# EAGLE design Glucose_Meter_Rev1 (EAGLE 7.6.0)
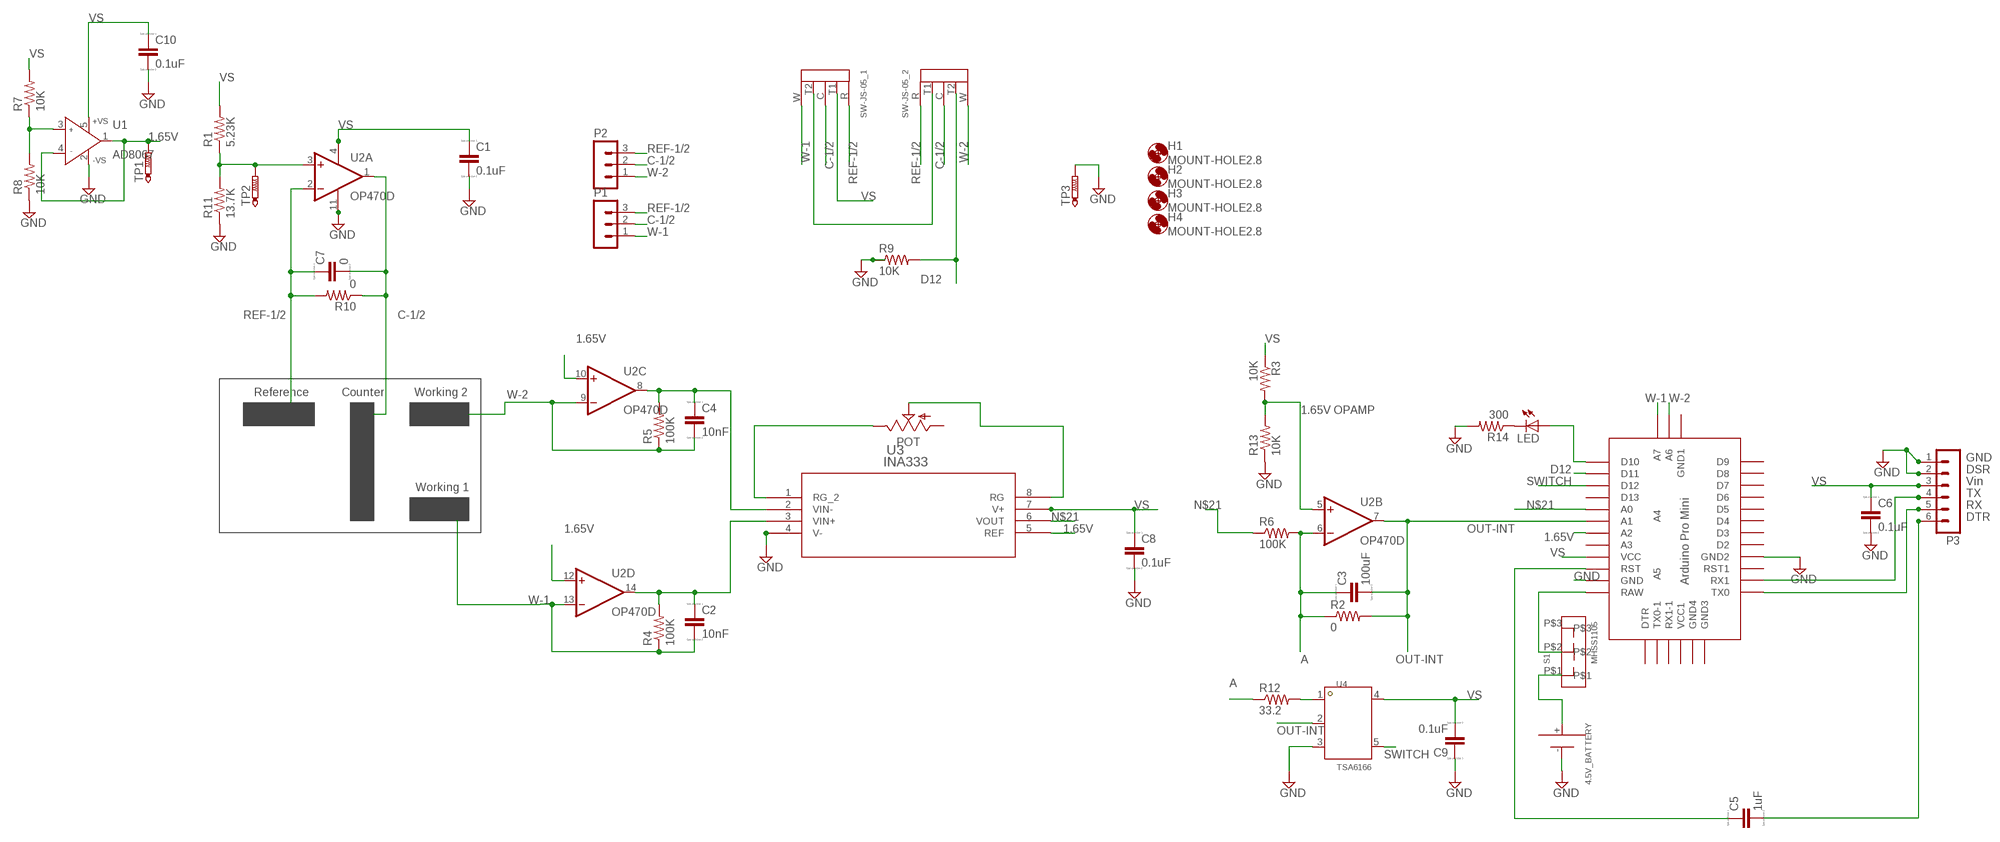
[diagram p0: schematic, sheet 1]

## Parts
4.5V_BATTERY  BC3AAAPC  [BC3AAAPC]
C1  0.1uF  C  [C0805]
C2  10nF  C  [C0805]
C3  100uF  CC1210  [C1210]
C4  10nF  C  [C0805]
C5  1uF  C  [C0805]
C6  0.1uF  C  [C0805]
C7  0  C  [C0805]
C8  0.1uF  C  [C0805]
C9  0.1uF  C  [C0805]
C10  0.1uF  C  [C0805]
H1  MOUNT-HOLE2.8  [2,8]
H2  MOUNT-HOLE2.8  [2,8]
H3  MOUNT-HOLE2.8  [2,8]
H4  MOUNT-HOLE2.8  [2,8]
LED  LED3MM  [LED3MM]
P1  MA03-1  [MA03-1]
P2  MA03-1  [MA03-1]
P3  MA06-1  [MA06-1]
POT  TRIM_US-RJ9W  [RJ9W]
R1  5.23K  R-US_R0805  [R0805]
R2  0  R-US_R0805  [R0805]
R3  10K  R-US_R0805  [R0805]
R4  100K  R-US_R0805  [R0805]
R5  100K  R-US_R0805  [R0805]
R6  100K  R-US_R0805  [R0805]
R7  10K  R-US_R0805  [R0805]
R8  10K  R-US_R0805  [R0805]
R9  10K  R-US_R0805  [R0805]
R10  0  R-US_R0805  [R0805]
R11  13.7K  R-US_R0805  [R0805]
R12  33.2  R-US_R0805  [R0805]
R13  10K  R-US_R0805  [R0805]
R14  300  R-US_R0805  [R0805]
S1  MHSS1105  [MHSS1105]
SW-JS-05_1  SW-JS-05  [SW-JS-05]
SW-JS-05_2  SW-JS-05  [SW-JS-05]
TP1  PTR1PAD1-13  [P1-13]
TP2  PTR1PAD1-13  [P1-13]
TP3  PTR1PAD1-13  [P1-13]
U1  AD8067  [SOT23-5]
U2  OP470D  [SO14]
U3  INA333  INA333_DGK_8  [DGK8]
U4  TSA6166  [SOT23-5]
U$1  ABK-PRO-MINI  [ABK-PRO-MINI]

## Nets
1.65V: TP1.TP U1.1(OUT) U1.4(IN-) U2.10(C:+IN) U2.12(D:+IN) U3.5(REF) U$1.A2
4.5V_BATTERY: S1.P$2 U$1.RAW
A: C3.1 R2.1 R6.2 R12.1 U2.6(B:-IN)
C-1/2: C7.2 P1.2 P2.2 R10.1 SW-JS-05_1.C SW-JS-05_2.C U2.1(A:OUT)
D12: R9.2 SW-JS-05_2.T2 U$1.D11
GND: 4.5V_BATTERY.- C1.2 C6.2 C8.2 C9.1 C10.2 P3.1 P3.2 R8.1 R9.1 R11.1 R13.1 R14.2 TP3.TP U1.2(-VS) U2.11(P:V-) U3.4(V-) U4.3(GND) U$1.GND U$1.GND1(GND2)
N: SW-JS-05_1.T2 SW-JS-05_2.T1
N$1: R12.2 U4.1(A)
N$2: R1.1 R11.2 TP2.TP U2.3(A:+IN)
N$5: C4.1 R5.2 U2.8(C:OUT) U3.2(VIN-)
N$6: LED.A U$1.D10
N$7: POT.E U3.1(RG_2)
N$8: POT.S U3.8(RG)
N$11: P3.4 U$1.RX1
N$12: R7.1 R8.2 U1.3(IN+)
N$13: P3.5 U$1.TX0
N$15: C5.2 P3.6
N$16: C5.1 U$1.RST
N$17: R3.2 R13.2 U2.5(B:+IN)
N$18: C2.1 R4.2 U2.14(D:OUT) U3.3(VIN+)
N$19: 4.5V_BATTERY.+ S1.P$1
N$20: LED.K(C) R14.1
N$21: R6.1 U3.6(VOUT) U$1.A0
OUT-INT: C3.2 R2.2 U2.7(B:OUT) U4.2(B) U$1.A1
REF-1/2: C7.1 P1.3 P2.3 R10.2 SW-JS-05_1.R SW-JS-05_2.R U2.2(A:-IN)
SWITCH: U4.5(ON/OFF) U$1.D12
VS: C1.1 C6.1 C8.1 C9.2 C10.1 P3.3 R1.2 R3.1 R7.2 SW-JS-05_1.T1 U1.5(+VS) U2.4(P:V+) U3.7(V+) U4.4(VS) U$1.VCC
W-1: C2.2 P1.1 R4.1 SW-JS-05_1.W U2.13(D:-IN) U$1.A7
W-2: C4.2 P2.1 R5.1 SW-JS-05_2.W U2.9(C:-IN) U$1.A6
Unconnected: POT.A S1.P$3 U$1.A3 U$1.A4 U$1.A5 U$1.D2 U$1.D3 U$1.D4 U$1.D5 U$1.D6 U$1.D7 U$1.D8 U$1.D9 U$1.D13 U$1.DTR U$1.GND2(GND3) U$1.GND3(GND4) U$1.GND4(GND1) U$1.RST1 U$1.RX1-1 U$1.TX0-1 U$1.VCC1

## Notes on the sheet
- Reference | Counter | Working 2
- 1.65V OPAMP
- GND
- DSR
- Vin
- Working 1
- TX
- RX
- DTR

## Library data of the parts
4.5V_BATTERY = Katrin's Footprint:BC3AAAPC: AAAx3 through hole battery holder BC3AAAPC. Untested.
C1-C10 = eagle-ltspice:C: CAPACITOR, European symbol; SPICEMODEL: NONE; SPICEPREFIX: C
H1-H4 = holes:MOUNT-HOLE: MOUNTING HOLE with drill center marker
LED = led:LED: LED OSRAM: - CHIPLED LG R971, LG N971, LY N971, LG Q971, LY Q971, LO R971, LY R971 LH N974, LH R974 LS Q976, LO Q976, LY Q976 LO Q996 - Hyper CHIPLED LW Q18S LB Q993, LB Q99A, LB R99A - SideLED LS A670, LO A670, LY A670, LG A670, LP A670 LB A673, LV A673, LT A673, LW A673 LH A674 LY A675 LS A676, LA A676, LO A676, LY A676, LW A676 LS A679, LY A679, LG A679 - Hyper Micro SIDELED® LS Y876, LA Y876, LO Y876, LY Y876 LT Y87S - SmartLED LW L88C, LW L88S LB L89C, LB L89S, LG L890 LS L89K, LO L89K, LY L89K LS L896, LA L896, LO L896, LY L896 - TOPLED LS T670, LO T670, LY T670, LG T670, LP T670 LSG T670, LSP T670, LSY T670, LOP T670, LYG T670 LG T671, LOG T671, LSG T671 LB T673, LV T673, LT T673, LW T673 LH T674 LS T676, LA T676, LO T676, LY T676, LB T676, LH T676, LSB T676, LW T676 LB T67C, LV T67C, LT T67C, LS T67K, LO T67K, LY T67K, LW E67C LS E67B, LA E67B, LO E67B, LY E67B, LB E67C, LV E67C, LT E67C LW T67C LS T679, LY T679, LG T679 LS T770, LO T770, LY T770, LG T770, LP T770 LB T773, LV T773, LT T773, LW T773 LH T774 LS E675, LA E675, LY E675, LS T675 LS T776, LA T776, LO T776, LY T776, LB T776 LHGB T686 LT T68C, LB T68C - Hyper Mini TOPLED® LB M676 - Mini TOPLED Santana® LG M470 LS M47K, LO M47K, LY M47K Source: http://www.osram.convergy.de LUXEON: - LUMILED® LXK2-PW12-R00, LXK2-PW12-S00, LXK2-PW14-U00, LXK2-PW14-V00 LXK2-PM12-R00, LXK2-PM12-S00, LXK2-PM14-U00 LXK2-PE12-Q00, LXK2-PE12-R00, LXK2-PE12-S00, LXK2-PE14-T00, LXK2-PE14-U00 LXK2-PB12-K00, LXK2-PB12-L00, LXK2-PB12-M00, LXK2-PB14-N00, LXK2-PB14-P00, LXK2-PB14-Q00 LXK2-PR12-L00, LXK2-PR12-M00, LXK2-PR14-Q00, LXK2-PR14-R00 LXK2-PD12-Q00, LXK2-PD12-R00, LXK2-PD12-S00 LXK2-PH12-R00, LXK2-PH12-S00 LXK2-PL12-P00, LXK2-PL12-Q00, LXK2-PL12-R00 Source: www.luxeon.com KINGBRIGHT: KA-3528ASYC Source: www.kingbright.com
P1 P2 = con-lstb:MA03-1: PIN HEADER; OC_FARNELL: unknown; OC_NEWARK: unknown
P3 = con-lstb:MA06-1: PIN HEADER; OC_FARNELL: unknown; OC_NEWARK: unknown
POT = pot:TRIM_US-: POTENTIOMETER
R1-R14 = resistor:R-US_: RESISTOR, American symbol
S1 = Katrin's Footprint:MHSS1105
SW-JS-05_1 SW-JS-05_2 = Katrin's Footprint:SW-JS-05: Footprint for SW-JS-05 connector for ONE TOUCH ULTRA glucose test strips
TP1-TP3 = testpad:PTR1: TEST PIN
U1 = analog-devices:AD8067: High Gain Bandwidth, Precision Fast FET(TM) Op Amp Source: http://www.analog.com/UploadedFiles/Data_Sheets/346131962AD8067_a.pdf; MF: ALTERA CORPORATION; MPN: AD8067ARTZ-REEL7; OC_FARNELL: 1464848; OC_NEWARK: 59K6326
U2 = linear:OP470: OP AMP
U3 = INA333:INA333_DGK_8; DATASHEETURL: http://www.ti.com/lit/gpn/INA333; FAMILY_NAME: SINGLE SUPPLY; GENERIC_PART_NUMBER: INA333; INDUSTRY_STD_PKG_TYPE: MSOP; MANUFACTURER: Texas Instruments; MANUFACTURER_PART_NUMBER: ina333_dgk_8; PACKAGE_DESIGNATOR: DGK; PIN_COUNT: 8; VENDOR: Texas Instruments
U4 = Katrin's Footprint:TSA6166
U$1 = Arduino-clone:ABK-PRO-MINI: ABK Pro-Mini Arduino Clone

## Board
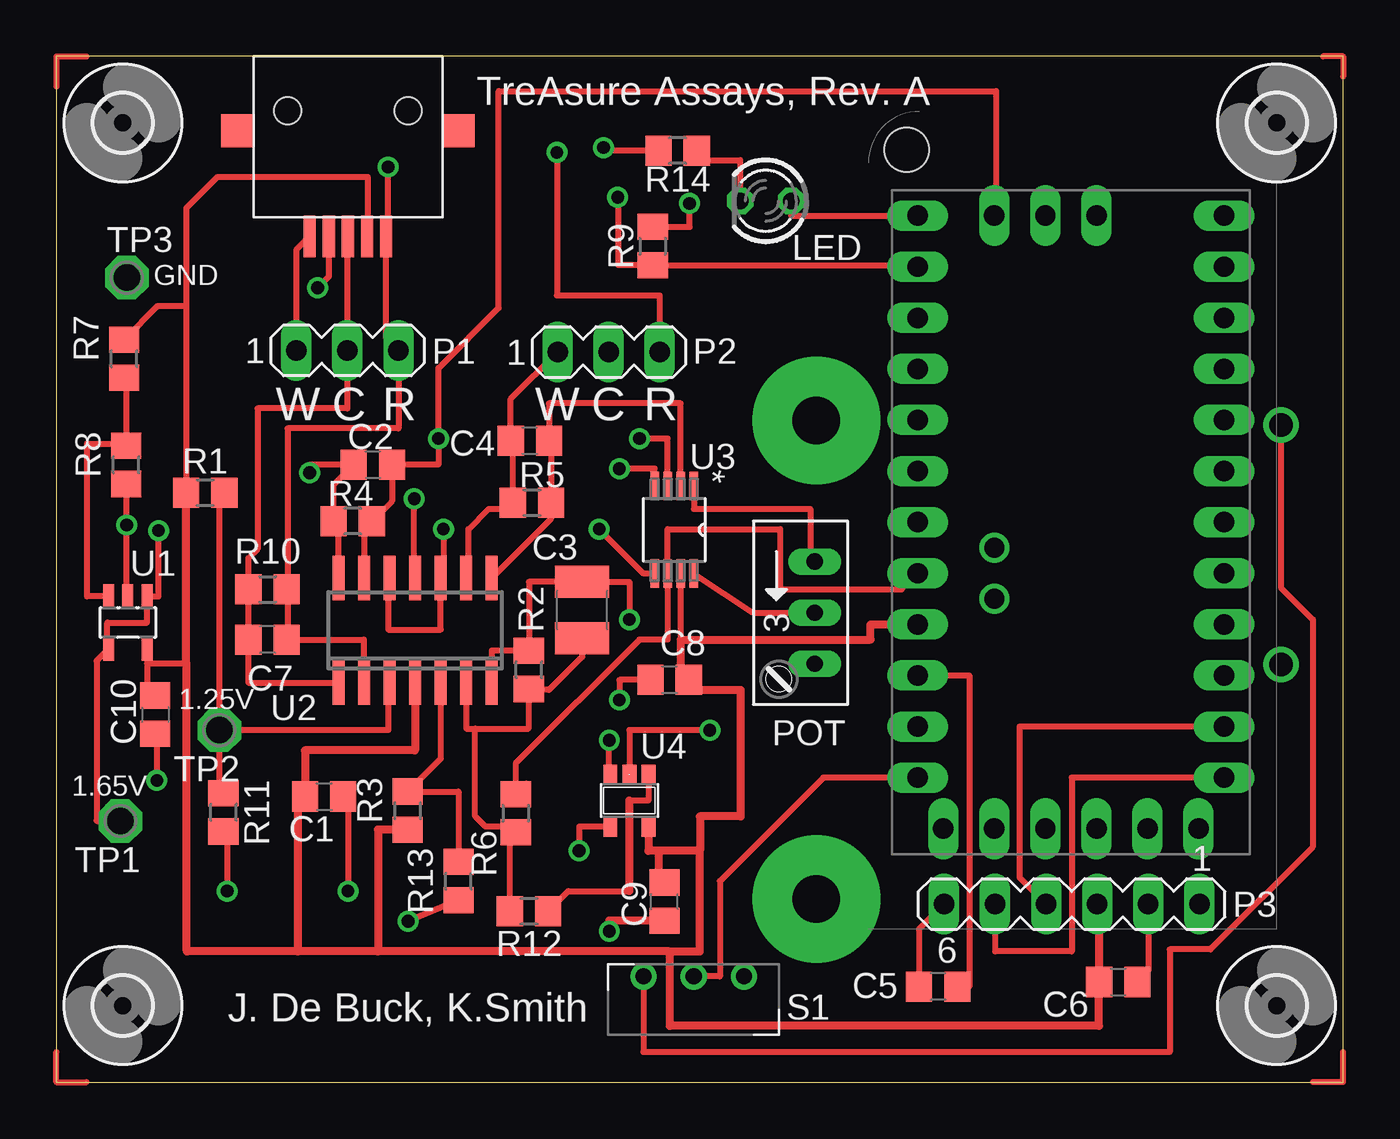
[diagram p1: board, top side]
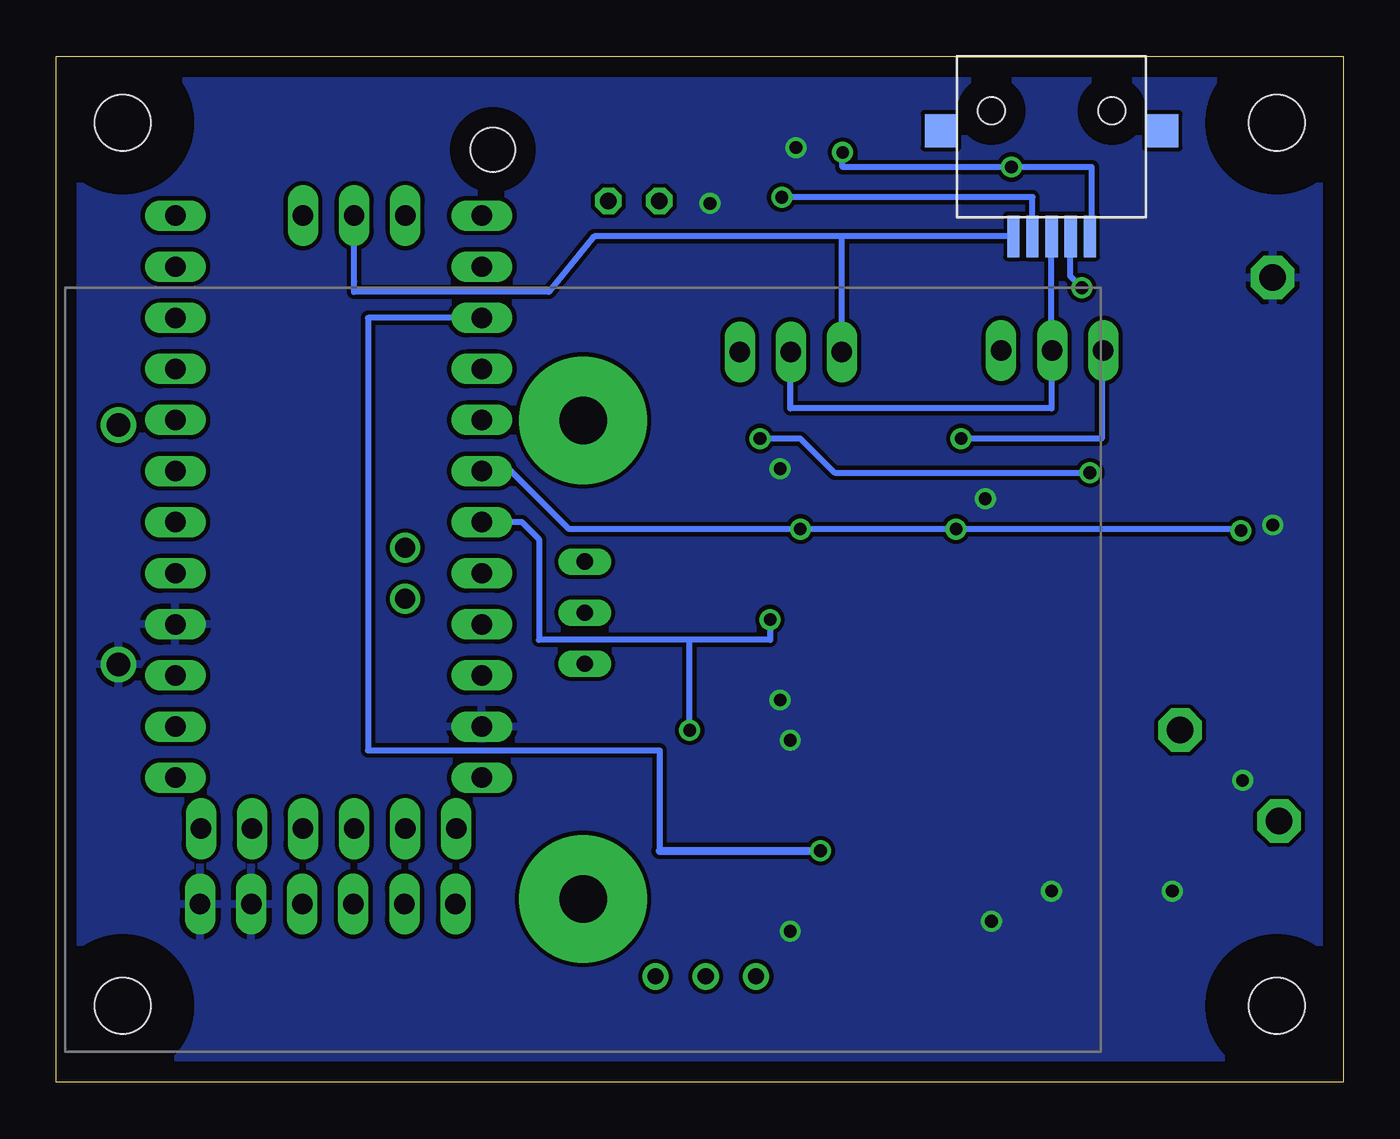
[diagram p2: board, bottom side, seen from below]

Size 64 x 51 mm. Coordinates in mm from the lower left corner, seen from the top.
Outline: 0,0 64,0 64,51 0,51 0,0
Copper layers (1*16): Top 0.035mm / dielectric 1.5mm / Bottom 0.035mm
Design rules "default *": minimum track width 10mil, minimum drill 24mil, track to track 8mil, track to pad 8mil, pad to pad 8mil, via to via 8mil, smd to smd 8mil, copper to edge 40mil, drill to drill 8mil, minimum pad ring 10mil, minimum via ring 8mil, stop-mask expansion 4mil, vias tented up to drill 0mil, thermal gap 10mil
Holes 2.2 mm at 42.29,46.35

### Footprints (pad centres in the part's own frame; a part is rotated, then mirrored left to right if it is on the bottom)
BC3AAAPC = drill 1.17: + 23.11,-12.17; - 23.11,-0.27 | drill 2.37 pad 6.35: P$1 0,11.39; P$3 0,-12.4
C0805 = smd 1.3 x 1.5: 1 -0.95,0; 2 0.95,0
C1210 = smd 1.6 x 2.7: 1 -1.4,0; 2 1.4,0
2,8 = hole 2.8: 0,0
LED3MM = drill 0.813 octagon: A -1.27,0; K 1.27,0
MA03-1 = drill 1.016 long: 1 -2.54,0; 2 0,0; 3 2.54,0
MA06-1 = drill 1.016 long: 1 -6.35,0; 2 -3.81,0; 3 -1.27,0; 4 1.27,0; 5 3.81,0; 6 6.35,0
RJ9W = drill 0.813 long: A 2.54,0.635; E -2.54,0.635; S 0,0.635
R0805 = smd 1.3 x 1.5: 1 -0.95,0; 2 0.95,0
MHSS1105 = drill 0.8: P$1 -2.5,1.155; P$2 0,1.155; P$3 2.5,1.155
SW-JS-05 = smd 0.605 x 2.067: C 0,4.95; R -1.9,4.95; T1 -0.95,4.95; T2 0.95,4.95; W 1.9,4.95 | smd 1.62 x 1.65: P$6 -5.5,-0.3; P$7 5.5,-0.3 | hole 1.35: -3,-1.3; 3,-1.3
P1-13 = drill 1.321 pad 2.159 octagon: TP 0,0
SOT23-5 = smd 0.55 x 1.2: 1 -0.95,-1.3; 2 0,-1.3; 3 0.95,-1.3; 4 0.95,1.3; 5 -0.95,1.3
SO14 = smd 0.6 x 2.2: 1 -3.81,-2.6; 2 -2.54,-2.6; 3 -1.27,-2.6; 4 0,-2.6; 5 1.27,-2.6; 6 2.54,-2.6; 7 3.81,-2.6; 8 3.81,2.6; 9 2.54,2.6; 10 1.27,2.6; 11 0,2.6; 12 -1.27,2.6; 13 -2.54,2.6; 14 -3.81,2.6
DGK8 = smd 1.422 x 0.432: 1 -2.172,0.975; 2 -2.172,0.325; 3 -2.172,-0.325; 4 -2.172,-0.975; 5 2.172,-0.975; 6 2.172,-0.325; 7 2.172,0.325; 8 2.172,0.975
SOT23-5' = smd 0.69 x 0.99: 1 -0.95,-1.29; 2 0,-1.29; 3 0.95,-1.29; 4 -0.95,1.3; 5 0.95,1.3
ABK-PRO-MINI = drill 1.016 long: A0 10.16,-3.81; A1 10.16,-6.35; A2 10.16,-8.89; A3 10.16,-11.43; A6 3.81,-21.59; A7 6.35,-21.59; D2 -5.08,-3.81; D3 -5.08,-6.35; D4 -5.08,-8.89; D5 -5.08,-11.43; D6 -5.08,-13.97; D7 -5.08,-16.51; D8 -5.08,-19.05; D9 -5.08,-21.59; D10 10.16,-21.59; D11 10.16,-19.05; D12 10.16,-16.51; D13 10.16,-13.97; DTR 8.89,8.89; GND 10.16,3.81; GND1 -5.08,-1.27; GND2 -3.81,8.89; GND3 -1.27,8.89; GND4 1.27,-21.59; RAW 10.16,6.35; RST 10.16,1.27; RST1 -5.08,1.27; RX1 -5.08,3.81; RX1-1 3.81,8.89; TX0 -5.08,6.35; TX0-1 6.35,8.89; VCC 10.16,-1.27; VCC1 1.27,8.89 | drill 0.991: A4 6.35,-5.08; A5 6.35,-2.54

### Placement (x,y rotation side)
4.5V_BATTERY  37.8,20.5 180 bottom
C1  13.32,14.2 0 top
C2  15.74,30.7 0 top
C3  26.15,23.48 90 top
C4  23.55,31.89 180 top
C5  43.86,4.75 180 top
C6  52.81,4.98 0 top
C7  10.5,22 180 top
C8  30.5,20 180 top
C9  30.25,8.98 90 top
C10  4.92,18.28 270 top
H1  3.3,3.8 0 top
H2  3.3,47.7 0 top
H3  60.7,47.7 0 top
H4  60.7,3.8 0 top
LED  35.28,43.82 180 top
P1  14.47,36.38 0 top
P2  27.47,36.3 0 top
P3  50.5,8.85 180 top
POT  37.08,23.34 270 top
R1  7.41,29.3 180 top
R2  23.5,20.5 90 top
R3  17.48,13.5 90 top
R4  14.74,27.89 180 top
R5  23.65,28.81 0 top
R6  22.85,13.37 270 top
R7  3.37,35.97 90 top
R8  3.47,30.69 90 top
R9  29.66,41.57 270 top
R10  10.5,24.5 0 top
R11  8.31,13.41 90 top
R12  23.5,8.5 0 top
R13  20,10 90 top
R14  30.9,46.32 180 top
S1  31.7,4.1 0 top
SW-JS-05_1  14.5,47 180 top
SW-JS-05_2  14.5,47 180 bottom
TP1  3.18,12.98 180 top
TP2  8.1,17.5 180 top
TP3  3.5,40 0 top
U1  3.56,22.85 180 top
U2  17.84,22.46 0 top
U3  30.73,27.46 270 top
U4  TSA6166  [SOT23-5']  28.5,14 180 top
U$1  53,21.49 180 top

### Tracks (layer width: path | path; a pad name or v marks a point on that pad's centre or on a via)
1.65V  (via drill 0.64)
  Top 0.305: U2.10 19.11,22.5 16.5,22.5 16.5,25.06 U2.12 | U2.10 19,25.06 | v19.25,27.5 19.25,25.2 U2.10 | v5.08,27.42 5.08,24.15 U1.1 4.51,22.85 2.54,22.85 2.54,21.55 U1.4 2,20.95 2,13 2.02,12.98 TP1.TP | U3.5 29.21,25.29 v27,27.5
  Bottom 0.305: v5.08,27.42 5.16,27.5 v19.25,27.5 v27,27.5 38.5,27.5 41.38,30.38 U$1.A2
4.5V_BATTERY
  Top 0.305: U$1.RAW 38.14,15.14 33,10 33,5.25 S1.P$2
A
  Top 0.305: U2.6 20.38,17.57 20.83,17.57 | 20.83,17.57 23.48,17.57 23.48,19.5 23.5,19.5 R2.1 23.55,19.5 24.5,19.5 26.15,21.15 C3.1 | 20.83,17.57 20.83,13.21 21.34,12.7 22.57,12.7 R6.2 22.55,12.12 R12.1
C-1/2
  Top 0.305: 14,19.86 U2.1 9.55,19.86 C7.2 R10.1 | SW-JS-05_2.C 14.47,42.02 P1.2 14.47,33.5 10,33.5 10,26.5 9.55,26.05 R10.1 | 9.5,24.55 arc90 R10.1
  Bottom 0.305: P1.2 14.5,36.41 | 14.5,36.41 SW-JS-05_2.C | 14.5,36.41 14.5,33.5 27.5,33.5 27.5,36.3 P2.2
D12  (via drill 0.64)
  Top 0.305: v27.92,44 27.94,44 27.94,40.64 29.66,40.64 R9.2 42.84,40.62 U$1.D11
  Bottom 0.305: SW-JS-05_2.T2 15.45,44 v27.92,44
GND  (via drill 0.64)
  Top 0.305: R8.1 3.47,27.7 v3.5,27.7 3.5,24.15 U1.2 | U2.11 arc-90 17.8,25.1 v17.8,29 | U4.3 27.5,15.29 v27.5,17 | C10.2 arc-90 5,17.25 v5,15 | R13.1 v17.5,8 | R14.2 27.22,46.32 v27.22,46.47 | U3.4 29.75,30.5 v28,30.5 | C8.2 28,20 v28,19 | P3.2 54.31,5.53 C6.2 | R11.1 8.5,12.46 v8.5,9.5 | 14.5,14.2 v14.5,9.5 | R9.1 31.5,42.52 v31.5,43.69
  Top 0.406: C1.2 14.5,14.2 | C9.1 27.5,8.03 v27.5,7.5
  pour Bottom: 0,51.01 63.83,51.01 63.83,0 0,0
N  (via drill 0.64)
  Top 0.305: SW-JS-05_1.T2 13.55,40.05 v13,39.5
  Bottom 0.305: v13,39.5 13.57,40.08 SW-JS-05_1.T2
N$1
  Top 0.305: U4.1 29.45,14 28.5,14 | R12.2 25.45,9.5 28.5,9.5
  Top 0.406: 28.5,9.5 28.5,14
N$2
  Top 0.305: U2.3 16.5,19.79 16.5,17.5 TP2.TP | R1.1 8.1,29.04 TP2.TP | TP2.TP 8.1,14.36 R11.2
N$5
  Top 0.305: U3.2 31.05,33.75 24.5,33.75 C4.1 24.75,31.64 24.6,31.64 R5.2 24.6,28.01 U2.8
N$6
  Top 0.305: LED.A 36.55,43.08 U$1.D10
N$7
  Top 0.305: U3.1 31.7,28.5 37.5,28.5 37.5,25.88 POT.E
N$8
  Top 0.305: U3.8 34.65,23.34 POT.S
N$10
  Top 0.305: 64,1.5 64,0 62.5,0
N$11
  Top 0.305: U$1.RX1 47.9,17.68 47.9,10.18 P3.4
N$12
  Top 0.305: R7.1 3.47,34.92 R8.2 3.47,31.74 1.52,31.74 1.52,24.15 U1.3
N$13
  Top 0.305: P3.5 46.69,6.5 50.5,6.5 50.5,15.14 U$1.TX0
N$15
  Top 0.305: P3.6 42.91,7.61 C5.2
N$16
  Top 0.305: U$1.RST 45.4,20.22 45.4,4.75 C5.1
N$17
  Top 0.305: U2.5 19.11,16.08 R3.2 20,14.45 R13.2
N$18  (via drill 0.64)
  Top 0.305: 13.94,25.06 U2.14 14.03,27.65 R4.2 13.79,29.7 C2.1 12.6,30.7 v12.6,30.3 | U3.3 30.41,32 v29,32
  Bottom 0.305: v12.6,30.3 25.3,30.3 27,32 v29,32
N$19
  Top 0.305: 4.5V_BATTERY.+ 60.91,24.59 62.5,23 62.48,22.98 62.48,11.68 57.4,6.6 55.37,6.6 55.37,1.5 29.2,1.5 S1.P$1
N$20
  Top 0.305: R14.1 32.32,45.85 34.01,45.85 LED.K
N$21
  Top 0.305: U$1.A0 42.04,24.5 36,24.5 36,27.5 30.41,27.5 U3.6 30.41,22 29,22 22.85,15.85 R6.1 23.37,14.84
N$22
  Top 0.305: 64,50 64,51 63,51
N$23
  Top 0.305: 0,49.5 0,51 1.5,51
N$24
  Top 0.305: 0,1.5 0,0 1.5,0
OUT-INT  (via drill 0.64)
  Top 0.305: U2.7 21.65,21.45 R2.2 23.5,24.88 C3.2 28.5,24.88 v28.5,23 | v32.5,17.5 28.5,17.5 U4.2
  Bottom 0.305: v32.5,17.5 32.5,21.98 | 32.5,21.98 40,21.98 40,27 40.84,27.84 U$1.A1 | v28.5,23 28.5,21.98 32.5,21.98
REF-1/2  (via drill 0.64)
  Top 0.305: U2.2 15.3,22 C7.1 | P1.3 | 11.5,24.5 11.5,32.5 17.01,32.5 P1.3 | P1.3 16.4,36.99 SW-JS-05_1.R 16.5,42.05 v16.5,45.5 | 11.95,22.5 11.95,22 C7.1 | 11.5,24.5 R10.2 | 11.5,24.5 11.5,22 C7.1 | P2.3 30.01,39.12 24.89,39.12 v24.89,46.23
  Bottom 0.305: SW-JS-05_2.R 12.6,42 12.5,42 12.5,45.5 v16.5,45.5 24.89,45.5 v24.89,46.23
SWITCH  (via drill 0.64)
  Top 0.305: U4.5 26,12.7 v26,11.5
  Bottom 0.305: U$1.D12 48.5,38 48.5,16.49 34,16.49 34,11.5
  Bottom 0.406: 34,11.5 v26,11.5
VS
  Top 0.305: U2.4 17.84,18.84 | 6.46,38.6 6.46,43.46 8,45 15.5,45 15.5,42.12 SW-JS-05_1.T1 | 6.46,38.6 R1.2 | R7.2 5.05,38.6 6.46,38.6 | U1.5 4.51,20.82 | 4.51,20.82 6.46,20.82 | 4.51,20.82 4.51,19.23 C10.1 | U3.7 31.05,22 | 31.05,20.39 C8.1 31.5,20 31.5,19.5 | C6.1 51.62,4.98
  Top 0.406: U2.4 17.84,16.5 12.37,16.5 C1.1 12,14.2 12,6.5 | R1.2 6.46,20.82 6.46,6.6 6.5,6.6 6.5,6.5 12,6.5 | 30.5,6.5 30.5,2.8 51.86,2.8 C6.1 51.86,8.5 P3.3 | R3.1 16,12.55 16,6.5 | U$1.VCC 40.5,22.76 40.5,22 31.05,22 31.05,20.39 | 30.5,6.5 32,6.5 32,11.5 | 32,11.5 29.97,11.5 | 29.97,11.5 29.45,11.5 U4.4 | 30.5,6.5 16,6.5 | 16,6.5 12,6.5 | C9.2 29.97,9.93 29.97,11.5 | 31.5,19.5 34.04,19.5 34.04,13.21 32,13.21 32,11.5
W-1  (via drill 0.64)
  Top 0.305: 15.19,25.17 U2.13 15.3,27.5 R4.1 16.69,28.89 C2.2 19,30.7 v19,32 19,35.5 22,38.5 22,49.28 46.74,49.28 46.74,43.59 U$1.A7 | SW-JS-05_1.W 11.93,41.38 P1.1
  Bottom 0.305: P1.1 12,36.31 12,32 v19,32
W-2
  Top 0.305: U2.9 20.5,25.18 20.5,27.5 21.5,28.5 22.39,28.5 R5.1 22.7,31.89 C4.2 22.6,33.97 P2.1
  Bottom 0.305: U$1.A6 49.19,39.81 49.2,39.29 39.5,39.29 37.25,42.05 25,42.05 | SW-JS-05_2.W 25,42.05 | P2.1 24.93,41.98 25,42.05

### Text on the board
tPlace: TreAsure Assays, Rev. A | GND | W | C | R | W | C | R | U3 | 1.25V | 1.65V | J. De Buck, K.Smith